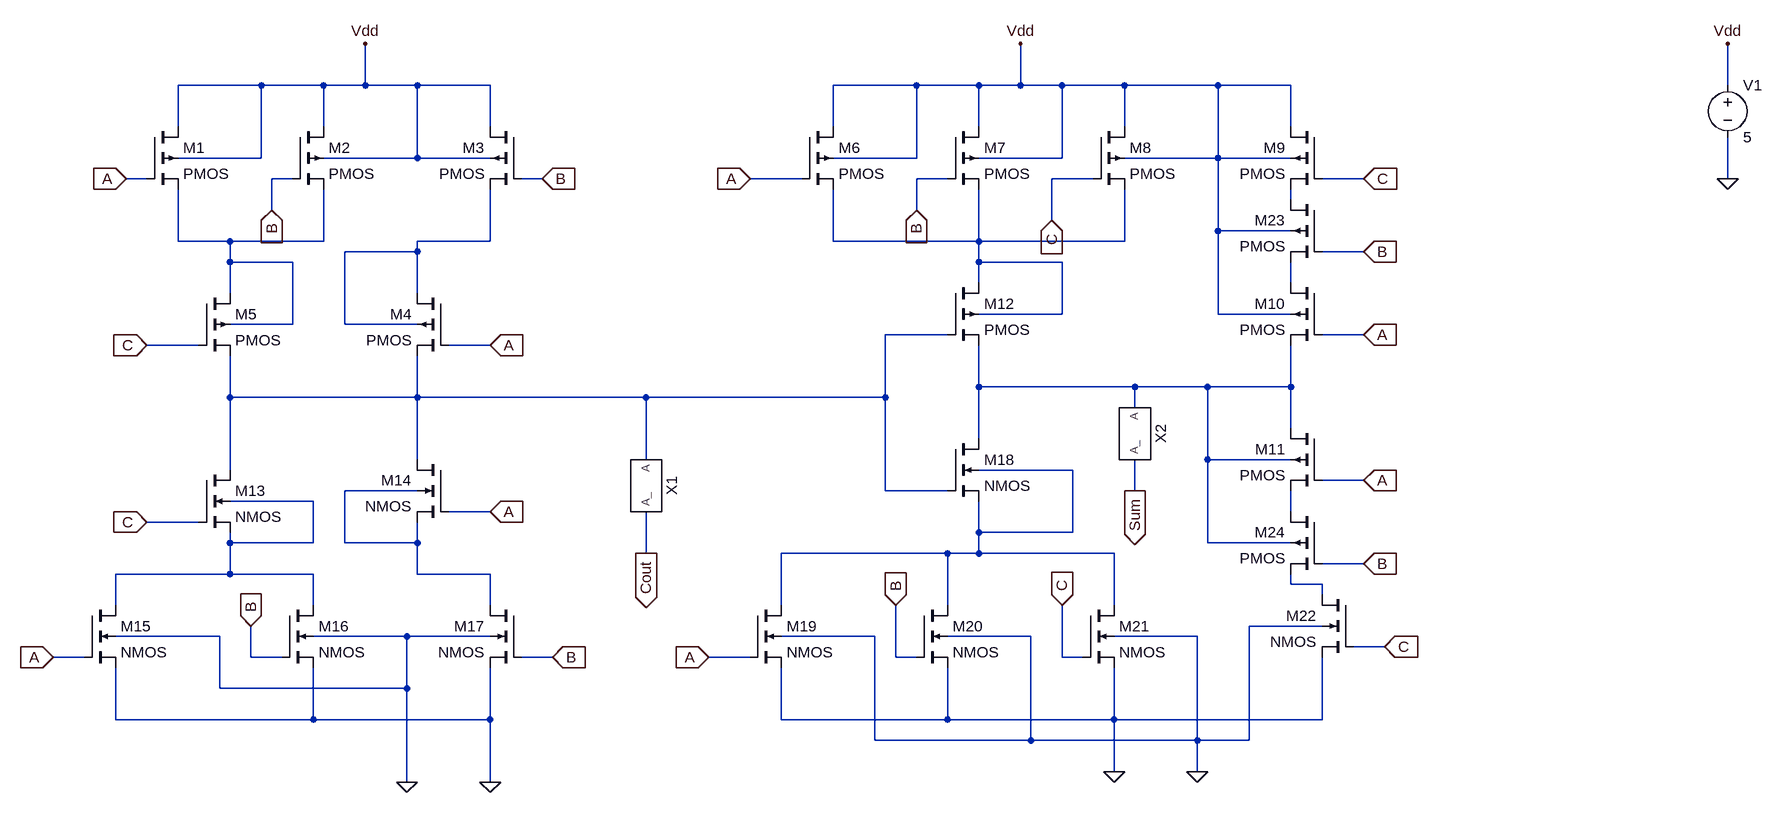
[diagram p0: schematic Draft2.asc]
Draft2.asc, the LTspice schematic file:
Version 4
SHEET 1 2632 1076
WIRE 320 -16 192 -16
WIRE 416 -16 320 -16
WIRE 480 -16 480 -80
WIRE 480 -16 416 -16
WIRE 560 -16 480 -16
WIRE 672 -16 560 -16
WIRE 1328 -16 1200 -16
WIRE 1424 -16 1328 -16
WIRE 1488 -16 1488 -80
WIRE 1488 -16 1424 -16
WIRE 1552 -16 1488 -16
WIRE 1648 -16 1552 -16
WIRE 1792 -16 1648 -16
WIRE 1904 -16 1792 -16
WIRE 2576 -16 2576 -80
WIRE 192 48 192 -16
WIRE 416 48 416 -16
WIRE 672 48 672 -16
WIRE 1200 48 1200 -16
WIRE 1424 48 1424 -16
WIRE 1648 48 1648 -16
WIRE 1904 48 1904 -16
WIRE 320 96 320 -16
WIRE 320 96 192 96
WIRE 560 96 560 -16
WIRE 560 96 416 96
WIRE 672 96 560 96
WIRE 1328 96 1328 -16
WIRE 1328 96 1200 96
WIRE 1552 96 1552 -16
WIRE 1552 96 1424 96
WIRE 1792 96 1792 -16
WIRE 1792 96 1648 96
WIRE 1904 96 1792 96
WIRE 144 128 112 128
WIRE 368 128 336 128
WIRE 752 128 720 128
WIRE 1152 128 1072 128
WIRE 1376 128 1328 128
WIRE 1600 128 1536 128
WIRE 2016 128 1952 128
WIRE 2576 128 2576 64
WIRE 1904 160 1904 144
WIRE 336 176 336 128
WIRE 1328 176 1328 128
WIRE 1536 192 1536 128
WIRE 1792 208 1792 96
WIRE 1904 208 1792 208
WIRE 192 224 192 144
WIRE 272 224 192 224
WIRE 416 224 416 144
WIRE 416 224 272 224
WIRE 672 224 672 144
WIRE 672 224 560 224
WIRE 1200 224 1200 144
WIRE 1424 224 1424 144
WIRE 1424 224 1200 224
WIRE 1648 224 1648 144
WIRE 1648 224 1424 224
WIRE 560 240 560 224
WIRE 560 240 448 240
WIRE 2016 240 1952 240
WIRE 272 256 272 224
WIRE 368 256 272 256
WIRE 1424 256 1424 224
WIRE 1552 256 1424 256
WIRE 1424 288 1424 256
WIRE 1904 288 1904 256
WIRE 272 304 272 256
WIRE 560 304 560 240
WIRE 1552 336 1552 256
WIRE 1552 336 1424 336
WIRE 1792 336 1792 208
WIRE 1904 336 1792 336
WIRE 368 352 368 256
WIRE 368 352 272 352
WIRE 448 352 448 240
WIRE 560 352 448 352
WIRE 1376 368 1280 368
WIRE 2016 368 1952 368
WIRE 224 384 144 384
WIRE 672 384 608 384
WIRE 1424 448 1424 384
WIRE 1664 448 1424 448
WIRE 1776 448 1664 448
WIRE 1904 448 1904 384
WIRE 1904 448 1776 448
WIRE 272 464 272 400
WIRE 560 464 560 400
WIRE 560 464 272 464
WIRE 912 464 560 464
WIRE 1280 464 1280 368
WIRE 1280 464 912 464
WIRE 1664 480 1664 448
WIRE 1904 512 1904 448
WIRE 1424 528 1424 448
WIRE 560 560 560 464
WIRE 912 560 912 464
WIRE 1776 560 1776 448
WIRE 1904 560 1776 560
WIRE 272 576 272 464
WIRE 1568 576 1424 576
WIRE 2016 592 1952 592
WIRE 560 608 448 608
WIRE 1280 608 1280 464
WIRE 1376 608 1280 608
WIRE 1664 608 1664 560
WIRE 400 624 272 624
WIRE 672 640 608 640
WIRE 1904 640 1904 608
WIRE 224 656 144 656
WIRE 1424 672 1424 624
WIRE 1568 672 1568 576
WIRE 1568 672 1424 672
WIRE 272 688 272 672
WIRE 400 688 400 624
WIRE 400 688 272 688
WIRE 448 688 448 608
WIRE 560 688 560 656
WIRE 560 688 448 688
WIRE 1776 688 1776 560
WIRE 1904 688 1776 688
WIRE 912 704 912 640
WIRE 1376 704 1120 704
WIRE 1424 704 1424 672
WIRE 1424 704 1376 704
WIRE 1632 704 1424 704
WIRE 2016 720 1952 720
WIRE 272 736 272 688
WIRE 272 736 96 736
WIRE 400 736 272 736
WIRE 560 736 560 688
WIRE 672 736 560 736
WIRE 1904 752 1904 736
WIRE 1952 752 1904 752
WIRE 1952 768 1952 752
WIRE 96 784 96 736
WIRE 400 784 400 736
WIRE 672 784 672 736
WIRE 1120 784 1120 704
WIRE 1376 784 1376 704
WIRE 1632 784 1632 704
WIRE 1952 816 1840 816
WIRE 256 832 96 832
WIRE 544 832 400 832
WIRE 672 832 544 832
WIRE 1264 832 1120 832
WIRE 1504 832 1376 832
WIRE 1760 832 1632 832
WIRE 2048 848 2000 848
WIRE 48 864 0 864
WIRE 304 864 304 816
WIRE 352 864 304 864
WIRE 768 864 720 864
WIRE 1072 864 1008 864
WIRE 1296 864 1296 784
WIRE 1328 864 1296 864
WIRE 1552 864 1552 784
WIRE 1584 864 1552 864
WIRE 256 912 256 832
WIRE 544 912 544 832
WIRE 544 912 256 912
WIRE 96 960 96 880
WIRE 400 960 400 880
WIRE 400 960 96 960
WIRE 672 960 672 880
WIRE 672 960 400 960
WIRE 1120 960 1120 880
WIRE 1376 960 1376 880
WIRE 1376 960 1120 960
WIRE 1632 960 1632 880
WIRE 1632 960 1376 960
WIRE 1952 960 1952 864
WIRE 1952 960 1632 960
WIRE 1264 992 1264 832
WIRE 1504 992 1504 832
WIRE 1504 992 1264 992
WIRE 1760 992 1760 832
WIRE 1760 992 1504 992
WIRE 1840 992 1840 816
WIRE 1840 992 1760 992
WIRE 1632 1040 1632 960
WIRE 1760 1040 1760 992
WIRE 544 1056 544 912
WIRE 672 1056 672 960
FLAG 112 128 A
IOPIN 112 128 In
FLAG 672 384 A
IOPIN 672 384 In
FLAG 0 864 A
IOPIN 0 864 In
FLAG 1072 128 A
IOPIN 1072 128 In
FLAG 1008 864 A
IOPIN 1008 864 In
FLAG 2016 368 A
IOPIN 2016 368 In
FLAG 2016 592 A
IOPIN 2016 592 In
FLAG 336 176 B
IOPIN 336 176 In
FLAG 752 128 B
IOPIN 752 128 In
FLAG 304 816 B
IOPIN 304 816 In
FLAG 768 864 B
IOPIN 768 864 In
FLAG 672 640 A
IOPIN 672 640 In
FLAG 1296 784 B
IOPIN 1296 784 In
FLAG 1328 176 B
IOPIN 1328 176 In
FLAG 2016 240 B
IOPIN 2016 240 In
FLAG 2016 720 B
IOPIN 2016 720 In
FLAG 144 384 C
IOPIN 144 384 In
FLAG 144 656 C
IOPIN 144 656 In
FLAG 2016 128 C
IOPIN 2016 128 In
FLAG 1536 192 C
IOPIN 1536 192 In
FLAG 2048 848 C
IOPIN 2048 848 In
FLAG 1552 784 C
IOPIN 1552 784 In
FLAG 1760 1040 0
FLAG 1632 1040 0
FLAG 672 1056 0
FLAG 544 1056 0
FLAG 480 -80 Vdd
FLAG 1488 -80 Vdd
FLAG 2576 128 0
FLAG 2576 -80 Vdd
FLAG 1664 608 Sum
IOPIN 1664 608 Out
FLAG 912 704 Cout
IOPIN 912 704 Out
SYMBOL pmos4 144 48 R0
SYMATTR InstName M1
SYMBOL pmos4 368 48 R0
SYMATTR InstName M2
SYMBOL pmos4 720 48 M0
SYMATTR InstName M3
SYMBOL pmos4 608 304 M0
SYMATTR InstName M4
SYMBOL pmos4 224 304 R0
SYMATTR InstName M5
SYMBOL pmos4 1152 48 R0
SYMATTR InstName M6
SYMBOL pmos4 1376 48 R0
SYMATTR InstName M7
SYMBOL pmos4 1600 48 R0
SYMATTR InstName M8
SYMBOL pmos4 1952 48 M0
SYMATTR InstName M9
SYMBOL pmos4 1952 288 M0
SYMATTR InstName M10
SYMBOL pmos4 1952 512 M0
SYMATTR InstName M11
SYMBOL pmos4 1376 288 R0
SYMATTR InstName M12
SYMBOL nmos4 224 576 R0
SYMATTR InstName M13
SYMBOL nmos4 608 560 M0
SYMATTR InstName M14
SYMBOL nmos4 48 784 R0
SYMATTR InstName M15
SYMBOL nmos4 352 784 R0
SYMATTR InstName M16
SYMBOL nmos4 720 784 M0
SYMATTR InstName M17
SYMBOL nmos4 1376 528 R0
SYMATTR InstName M18
SYMBOL nmos4 1072 784 R0
SYMATTR InstName M19
SYMBOL nmos4 1328 784 R0
SYMATTR InstName M20
SYMBOL nmos4 1584 784 R0
SYMATTR InstName M21
SYMBOL nmos4 2000 768 M0
SYMATTR InstName M22
SYMBOL pmos4 1952 160 M0
SYMATTR InstName M23
SYMBOL pmos4 1952 640 M0
SYMATTR InstName M24
SYMBOL voltage 2576 -32 R0
WINDOW 123 0 0 Left 0
WINDOW 39 0 0 Left 0
SYMATTR InstName V1
SYMATTR Value 5
SYMBOL INVERT 912 592 R90
SYMATTR InstName X1
SYMBOL INVERT 1664 512 R90
SYMATTR InstName X2

The netlist it stands for:
* Draft2.asc
M1 Vdd A N002 Vdd PMOS
M2 Vdd B N002 Vdd PMOS
M3 Vdd B N003 Vdd PMOS
M4 N003 A N006 N003 PMOS
M5 N002 C N006 N002 PMOS
M6 Vdd A N004 Vdd PMOS
M7 Vdd B N004 Vdd PMOS
M8 Vdd C N004 Vdd PMOS
M9 Vdd C N001 Vdd PMOS
M10 N005 A N007 Vdd PMOS
M11 N007 A N011 N007 PMOS
M12 N004 N006 N007 N004 PMOS
M13 N006 C N010 N010 NMOS
M14 N006 A N009 N009 NMOS
M15 N010 A 0 0 NMOS
M16 N010 B 0 0 NMOS
M17 N009 B 0 0 NMOS
M18 N007 N006 N008 N008 NMOS
M19 N008 A 0 0 NMOS
M20 N008 B 0 0 NMOS
M21 N008 C 0 0 NMOS
M22 N012 C 0 0 NMOS
M23 N001 B N005 Vdd PMOS
M24 N011 B N012 N007 PMOS
V1 Vdd 0 5
XX1 N006 Cout INVERT  ; pins A A_
XX2 N007 Sum INVERT  ; pins A A_
.model NMOS NMOS
.model PMOS PMOS
.lib standard.mos
.backanno
.end